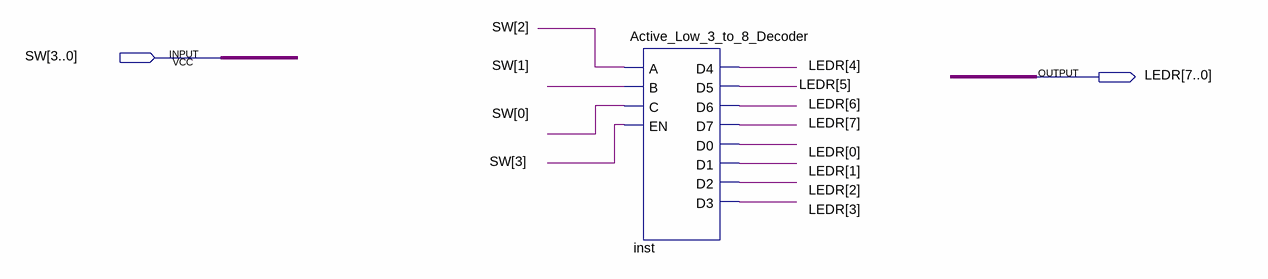
[diagram p0: schematic sheet]
// Quartus schematic Top_Level_3_to_8_Decoder.bdf as structural Verilog: 1 symbols, 2 pins
module Top_Level_3_to_8_Decoder (
  input  [3:0] SW,
  output [7:0] LEDR
);

  Active_Low_3_to_8_Decoder inst (
    .A(SW[2]), .B(SW[1]), .C(SW[0]), .EN(SW[3]), .D4(LEDR[4]), .D5(LEDR[5]), .D6(LEDR[6]), .D7(LEDR[7]),
    .D0(LEDR[0]), .D1(LEDR[1]), .D2(LEDR[2]), .D3(LEDR[3]));
endmodule
